# Altium project PCB_Project1.PrjPCB
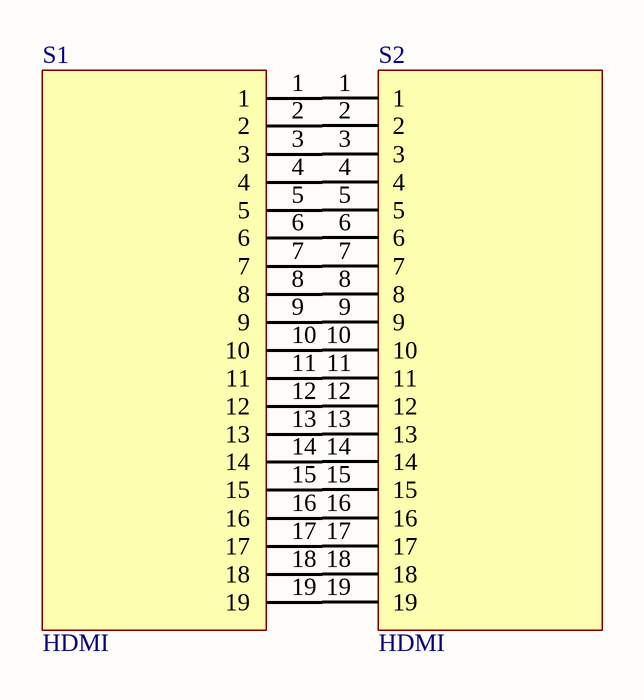
[diagram p0: Sheet1.SchDoc]
1 sheet, 2 parts. Net scope: global (net labels, ports and power ports of the same name join across sheets).
Board file: PCB1.PcbDoc

## Sheet Sheet1.SchDoc
size A4

### Parts
S1  HDMI  [HDMI PLUG]
S2  HDMI  [HDMI PLUG]

### Nets
NetS1_1: S1.1 S2.1
NetS1_2: S1.2 S2.2
NetS1_3: S1.3 S2.3
NetS1_4: S1.4 S2.4
NetS1_5: S1.5 S2.5
NetS1_6: S1.6 S2.6
NetS1_7: S1.7 S2.7
NetS1_8: S1.8 S2.8
NetS1_9: S1.9 S2.9
NetS1_10: S1.10 S2.10
NetS1_11: S1.11 S2.11
NetS1_12: S1.12 S2.12
NetS1_13: S1.13 S2.13
NetS1_14: S1.14 S2.14
NetS1_15: S1.15 S2.15
NetS1_16: S1.16 S2.16
NetS1_17: S1.17 S2.17
NetS1_18: S1.18 S2.18
NetS1_19: S1.19 S2.19